# Altium schematic sheet Onlab.SchDoc
size A; SheetNumber: 1; SheetTotal: 4
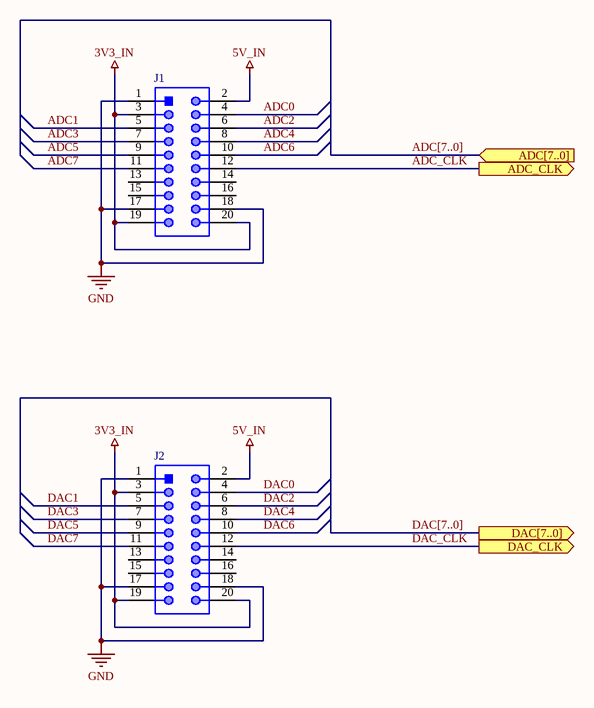
[diagram p0: Onlab.SchDoc]

## Parts
J1  61302021021  [61302021021]  (value not drawn)
J2  61302021021  [61302021021]  (value not drawn)

## Ports
ADC[7..0] (in), ADC_CLK (out), DAC[7..0] (out), DAC_CLK (out)

## Nets
3V3_IN: J1.3 J1.19 J1.20 J2.3 J2.19 J2.20
5V_IN: J1.2 J2.2
GND: J1.1 J1.17 J1.18 J2.1 J2.17 J2.18
ADC0: J1.4
ADC1: J1.5
ADC2: J1.6
ADC3: J1.7
ADC4: J1.8
ADC5: J1.9
ADC6: J1.10
ADC7: J1.11
ADC_CLK: J1.12 ; port ADC_CLK
DAC0: J2.4
DAC1: J2.5
DAC2: J2.6
DAC3: J2.7
DAC4: J2.8
DAC5: J2.9
DAC6: J2.10
DAC7: J2.11
DAC_CLK: J2.12 ; port DAC_CLK

Not connected (* = marked no-connect by the designer): J1 13 14 15 16; J2 13 14 15 16

## Buses and harness runs
bus ADC[7..0] = port ADC[7..0]
bus DAC[7..0] = port DAC[7..0]

## Library data of the parts
J1 J2 = CMP-1502-01103-1: THT Angled Pin Header WR-PHD, Pitch 2.54 mm, Dual Row, 20 pins; Manufacturer: Wurth Elektronik; Working Voltage: 250VAC; Pin Number: 20; Contact Resistance: 20mOhm; Pitch: 2.54mm; Withstanding Voltage: 500VAC; Rated Current: 3A; Gender: Male; Manufacturer URL: http://www.we-online.de; Mounting Technology: THT; Packaging: Bag; Orientation: Angled; Package Reference: 61302021021; Publisher: WurthElektronik; Datasheet URL: https://katalog.we-online.de/em/datasheet/6130xx21021.pdf; Operating Temperature: -40to105degC; Part Number: 61302021021; Row Number: Dual